# Altium schematic sheet IMX7S_CPU_POWER.SchDoc
size A2
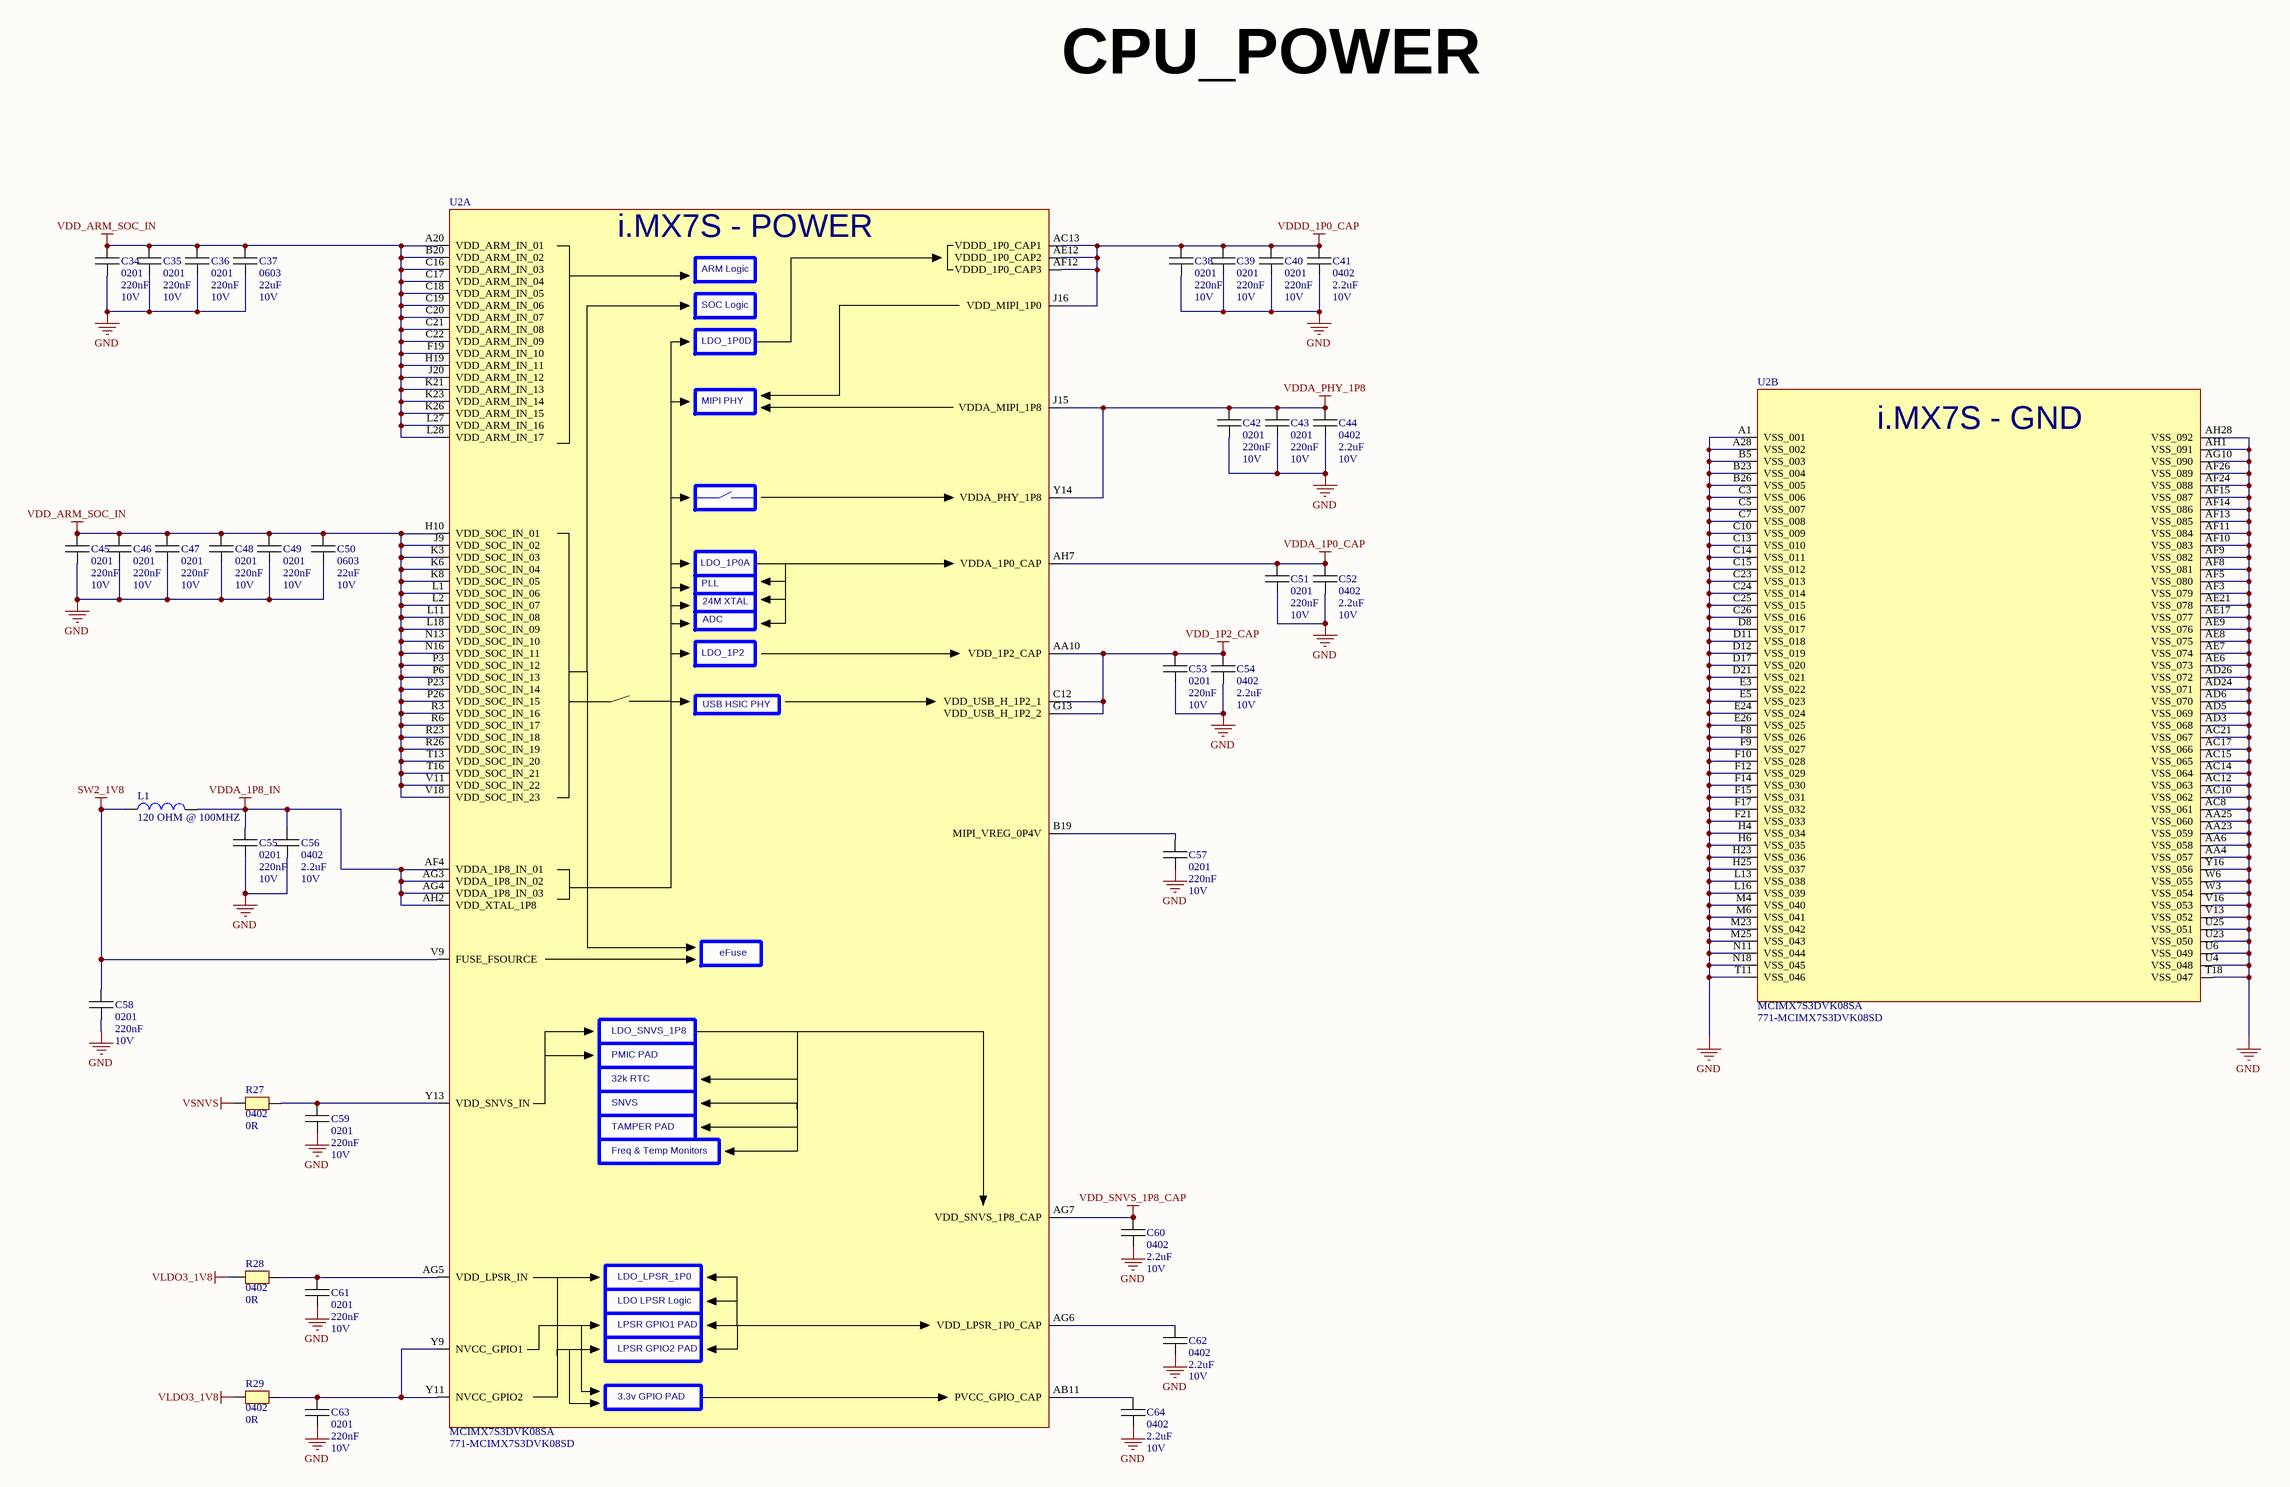
[diagram p0: IMX7S_CPU_POWER.SchDoc]

## Parts
C34  value 220nF  PACKAGE: 0201  VOLTAGE: 10V  [C0201]  (hidden comment: C0201)
C35  value 220nF  PACKAGE: 0201  VOLTAGE: 10V  [C0201]  (hidden comment: C0201)
C36  value 220nF  PACKAGE: 0201  VOLTAGE: 10V  [C0201]  (hidden comment: C0201)
C37  value 22uF  PACKAGE: 0603  VOLTAGE: 10V  [C0603]  (hidden comment: C0603)
C38  value 220nF  PACKAGE: 0201  VOLTAGE: 10V  [C0201]  (hidden comment: C0201)
C39  value 220nF  PACKAGE: 0201  VOLTAGE: 10V  [C0201]  (hidden comment: C0201)
C40  value 220nF  PACKAGE: 0201  VOLTAGE: 10V  [C0201]  (hidden comment: C0201)
C41  value 2.2uF  PACKAGE: 0402  VOLTAGE: 10V  [C0402]  (hidden comment: C0402)
C42  value 220nF  PACKAGE: 0201  VOLTAGE: 10V  [C0201]  (hidden comment: C0201)
C43  value 220nF  PACKAGE: 0201  VOLTAGE: 10V  [C0201]  (hidden comment: C0201)
C44  value 2.2uF  PACKAGE: 0402  VOLTAGE: 10V  [C0402]  (hidden comment: C0402)
C45  value 220nF  PACKAGE: 0201  VOLTAGE: 10V  [C0201]  (hidden comment: C0201)
C46  value 220nF  PACKAGE: 0201  VOLTAGE: 10V  [C0201]  (hidden comment: C0201)
C47  value 220nF  PACKAGE: 0201  VOLTAGE: 10V  [C0201]  (hidden comment: C0201)
C48  value 220nF  PACKAGE: 0201  VOLTAGE: 10V  [C0201]  (hidden comment: C0201)
C49  value 220nF  PACKAGE: 0201  VOLTAGE: 10V  [C0201]  (hidden comment: C0201)
C50  value 22uF  PACKAGE: 0603  VOLTAGE: 10V  [C0603]  (hidden comment: C0603)
C51  value 220nF  PACKAGE: 0201  VOLTAGE: 10V  [C0201]  (hidden comment: C0201)
C52  value 2.2uF  PACKAGE: 0402  VOLTAGE: 10V  [C0402]  (hidden comment: C0402)
C53  value 220nF  PACKAGE: 0201  VOLTAGE: 10V  [C0201]  (hidden comment: C0201)
C54  value 2.2uF  PACKAGE: 0402  VOLTAGE: 10V  [C0402]  (hidden comment: C0402)
C55  value 220nF  PACKAGE: 0201  VOLTAGE: 10V  [C0201]  (hidden comment: C0201)
C56  value 2.2uF  PACKAGE: 0402  VOLTAGE: 10V  [C0402]  (hidden comment: C0402)
C57  value 220nF  PACKAGE: 0201  VOLTAGE: 10V  [C0201]  (hidden comment: C0201)
C58  value 220nF  PACKAGE: 0201  VOLTAGE: 10V  [C0201]  (hidden comment: C0201)
C59  value 220nF  PACKAGE: 0201  VOLTAGE: 10V  [C0201]  (hidden comment: C0201)
C60  value 2.2uF  PACKAGE: 0402  VOLTAGE: 10V  [C0402]  (hidden comment: C0402)
C61  value 220nF  PACKAGE: 0201  VOLTAGE: 10V  [C0201]  (hidden comment: C0201)
C62  value 2.2uF  PACKAGE: 0402  VOLTAGE: 10V  [C0402]  (hidden comment: C0402)
C63  value 220nF  PACKAGE: 0201  VOLTAGE: 10V  [C0201]  (hidden comment: C0201)
C64  value 2.2uF  PACKAGE: 0402  VOLTAGE: 10V  [C0402]  (hidden comment: C0402)
L1  value 120 OHM @ 100MHZ  [SELF]  (hidden comment: Self)
R27  value 0R  PACKAGE: 0402  [R0402]  (hidden comment: R0402)
R28  value 0R  PACKAGE: 0402  [R0402]  (hidden comment: R0402)
R29  value 0R  PACKAGE: 0402  [R0402]  (hidden comment: R0402)
U2  MCIMX7S3DVK08SA  Supplier Part Number 1: 771-MCIMX7S3DVK08SD  [BGA 488 PIN]  (parts A,B of 13)

## Nets
GND: C34.1 C35.1 C36.1 C37.1 C38.1 C39.1 C40.1 C41.1 C42.1 C43.1 C44.1 C45.1 C46.1 C47.1 C48.1 C49.1 C50.1 C51.1 C52.1 C53.1 C54.1 C55.1 C56.1 C57.1 C58.1 C59.1 C60.1 C61.1 C62.1 C63.1 C64.1 U2.A1(VSS_001) U2.A28(VSS_002) U2.AA4(VSS_057) U2.AA6(VSS_058) U2.AA23(VSS_059) U2.AA25(VSS_060) U2.AC8(VSS_061) U2.AC10(VSS_062) U2.AC12(VSS_063) U2.AC14(VSS_064) U2.AC15(VSS_065) U2.AC17(VSS_066) U2.AC21(VSS_067) U2.AD3(VSS_068) U2.AD5(VSS_069) U2.AD6(VSS_070) U2.AD24(VSS_071) U2.AD26(VSS_072) U2.AE6(VSS_073) U2.AE7(VSS_074) U2.AE8(VSS_075) U2.AE9(VSS_076) U2.AE17(VSS_077) U2.AE21(VSS_078) U2.AF3(VSS_079) U2.AF5(VSS_080) U2.AF8(VSS_081) U2.AF9(VSS_082) U2.AF10(VSS_083) U2.AF11(VSS_084) U2.AF13(VSS_085) U2.AF14(VSS_086) U2.AF15(VSS_087) U2.AF24(VSS_088) U2.AF26(VSS_089) U2.AG10(VSS_090) U2.AH1(VSS_091) U2.AH28(VSS_092) U2.B5(VSS_003) U2.B23(VSS_004) U2.B26(VSS_005) U2.C3(VSS_006) U2.C5(VSS_007) U2.C7(VSS_008) U2.C10(VSS_009) U2.C13(VSS_010) U2.C14(VSS_011) U2.C15(VSS_012) U2.C23(VSS_013) U2.C24(VSS_014) U2.C25(VSS_015) U2.C26(VSS_016) U2.D8(VSS_017) U2.D11(VSS_018) U2.D12(VSS_019) U2.D17(VSS_020) U2.D21(VSS_021) U2.E3(VSS_022) U2.E5(VSS_023) U2.E24(VSS_024) U2.E26(VSS_025) U2.F8(VSS_026) U2.F9(VSS_027) U2.F10(VSS_028) U2.F12(VSS_029) U2.F14(VSS_030) U2.F15(VSS_031) U2.F17(VSS_032) U2.F21(VSS_033) U2.H4(VSS_034) U2.H6(VSS_035) U2.H23(VSS_036) U2.H25(VSS_037) U2.L13(VSS_038) U2.L16(VSS_039) U2.M4(VSS_040) U2.M6(VSS_041) U2.M23(VSS_042) U2.M25(VSS_043) U2.N11(VSS_044) U2.N18(VSS_045) U2.T11(VSS_046) U2.T18(VSS_047) U2.U4(VSS_048) U2.U6(VSS_049) U2.U23(VSS_050) U2.U25(VSS_051) U2.V13(VSS_052) U2.V16(VSS_053) U2.W3(VSS_054) U2.W6(VSS_055) U2.Y16(VSS_056)
SW2_1V8: C58.2 L1.1 U2.V9(FUSE_FSOURCE)
VDD_1P2_CAP: C53.2 C54.2 U2.AA10(VDD_1P2_CAP) U2.C12(VDD_USB_H_1P2_1) U2.G13(VDD_USB_H_1P2_2)
VDD_ARM_SOC_IN: C34.2 C35.2 C36.2 C37.2 C45.2 C46.2 C47.2 C48.2 C49.2 C50.2 U2.A20(VDD_ARM_IN_01) U2.B20(VDD_ARM_IN_02) U2.C16(VDD_ARM_IN_03) U2.C17(VDD_ARM_IN_04) U2.C18(VDD_ARM_IN_05) U2.C19(VDD_ARM_IN_06) U2.C20(VDD_ARM_IN_07) U2.C21(VDD_ARM_IN_08) U2.C22(VDD_ARM_IN_09) U2.F19(VDD_ARM_IN_10) U2.H10(VDD_SOC_IN_01) U2.H19(VDD_ARM_IN_11) U2.J9(VDD_SOC_IN_02) U2.J20(VDD_ARM_IN_12) U2.K3(VDD_SOC_IN_03) U2.K6(VDD_SOC_IN_04) U2.K8(VDD_SOC_IN_05) U2.K21(VDD_ARM_IN_13) U2.K23(VDD_ARM_IN_14) U2.K26(VDD_ARM_IN_15) U2.L1(VDD_SOC_IN_06) U2.L2(VDD_SOC_IN_07) U2.L11(VDD_SOC_IN_08) U2.L18(VDD_SOC_IN_09) U2.L27(VDD_ARM_IN_16) U2.L28(VDD_ARM_IN_17) U2.N13(VDD_SOC_IN_10) U2.N16(VDD_SOC_IN_11) U2.P3(VDD_SOC_IN_12) U2.P6(VDD_SOC_IN_13) U2.P23(VDD_SOC_IN_14) U2.P26(VDD_SOC_IN_15) U2.R3(VDD_SOC_IN_16) U2.R6(VDD_SOC_IN_17) U2.R23(VDD_SOC_IN_18) U2.R26(VDD_SOC_IN_19) U2.T13(VDD_SOC_IN_20) U2.T16(VDD_SOC_IN_21) U2.V11(VDD_SOC_IN_22) U2.V18(VDD_SOC_IN_23)
VDD_SNVS_1P8_CAP: C60.2 U2.AG7(VDD_SNVS_1P8_CAP)
VDDA_1P0_CAP: C51.2 C52.2 U2.AH7(VDDA_1P0_CAP)
VDDA_1P8_IN: C55.2 C56.2 L1.2 U2.AF4(VDDA_1P8_IN_01) U2.AG3(VDDA_1P8_IN_02) U2.AG4(VDDA_1P8_IN_03) U2.AH2(VDD_XTAL_1P8)
VDDA_PHY_1P8: C42.2 C43.2 C44.2 U2.J15(VDDA_MIPI_1P8) U2.Y14(VDDA_PHY_1P8)
VDDD_1P0_CAP: C38.2 C39.2 C40.2 C41.2 U2.AC13(VDDD_1P0_CAP1) U2.AE12(VDDD_1P0_CAP2) U2.AF12(VDDD_1P0_CAP3) U2.J16(VDD_MIPI_1P0)
VLDO3_1V8: R28.1 R29.1
VSNVS: R27.1
NetC57_2: C57.2 U2.B19(MIPI_VREG_0P4V)
NetC59_2: C59.2 R27.2 U2.Y13(VDD_SNVS_IN)
NetC61_2: C61.2 R28.2 U2.AG5(VDD_LPSR_IN)
NetC62_2: C62.2 U2.AG6(VDD_LPSR_1P0_CAP)
NetC63_2: C63.2 R29.2 U2.Y9(NVCC_GPIO1) U2.Y11(NVCC_GPIO2)
NetC64_2: C64.2 U2.AB11(PVCC_GPIO_CAP)

## Notes on the sheet
- CPU_POWER
- Title
- Size:
- Date:
- File:
- A2
- Number:
- Time:
- Revision:
- Sheet
- of
- (in symbol MCIMX7S3DVK08SD, part A) i.MX7S - POWER; ARM Logic; SOC Logic; LDO_1P0D; MIPI PHY; LDO_1P0A; PLL; 24M XTAL; ADC; LDO_1P2; USB HSIC PHY; eFuse; LDO_SNVS_1P8; PMIC PAD; 32k RTC; SNVS; TAMPER PAD; Freq & Temp Monitors; LDO_LPSR_1P0; LDO LPSR Logic; LPSR GPIO1 PAD; LPSR GPIO2 PAD; 3.3v GPIO PAD
- (in symbol MCIMX7S3DVK08SD, part B) i.MX7S - GND

## Library data of the parts
C34-C36 C38-C40 C42 C43 C45-C49 C51 C53 C55 C57-C59 C61 C63 = C0201: Manufacturer 1: Murata; Manufacturer Part Number 1: GRM033R61A224KE90D; Tolerance: 10%; Dielectric: X5R; Supplier 1: Farnell; Supplier Part Number 1: 2990687; Stock 1: 4290; Pricing 1: 10=0,04270, 100=0,02370, 500=0,01800, 2500=0,01350, 7500=0,00950, 15000=0,00760, 75000=0,00630 (EUR); RoHS: Yes; Mount: Surface Mount; Case/Package: 0201; Case Code (Metric): 0603; Case Code (Imperial): 0201; Min Operating Temperature: -55°C; Max Operating Temperature: 85°C; Capacitance: 220nF; Voltage Rating (DC): 10V; Packaging: Tape and Reel; Voltage Rating: 10V; Length: 0.024inch; Width: 0.012inch; Thickness: 0.013inch; ComponentLink1URL: http://www.mouser.com/ds/2/281/c02e-2905.pdf?src-supplier=Mouser; ComponentLink1Description: http://www.mouser.com/ds/2/281/c02e-2905.pdf?src-supplier=Mouser; ComponentLink2URL: http://search.murata.co.jp/Ceramy/image/img/A01X/G101/ENG/GRM033R61A224KE90-01.pdf?src-supplier=Digi-Key; ComponentLink2Description: http://search.murata.co.jp/Ceramy/image/img/A01X/G101/ENG/GRM033R61A224KE90-01.pdf?src-supplier=Digi-Key
C37 C50 = C0603: Manufacturer 1: Murata; Manufacturer Part Number 1: GRM188R60J226MEA0D; Description: Cap Ceramic 22uF 6.3V X5R 20% SMD 0603 85C Paper T/R; Tolerance: 20%; Voltage Rating: 6.3V; Dielectric: X5R; Supplier 1: Farnell; Supplier Part Number 1: 2666490; Stock 1: 3836000; Pricing 1: 4000=0,03830, 20000=0,03750 (EUR); RoHS: Yes; Mount: Surface Mount; Case/Package: 0603; Weight: 0.000222oz; Case Code (Metric): 1608; Case Code (Imperial): 0603; Min Operating Temperature: -55°C; Max Operating Temperature: 85°C; Capacitance: 22uF; Packaging: Tape and Reel; Package Quantity: 4000; Termination: SMD/SMT; Voltage Rating (DC): 6.3V; Length: 1.6mm; Height: 0.8mm; Width: 0.8mm; Thickness: 0.039inch; Depth: 0.8mm; REACH SVHC: No SVHC; Lead Free: Lead Free; ComponentLink1URL: https://datasheet.ciiva.com/29540/partnumbering-e-01-29540443.pdf?src-supplier=Digi-Key; ComponentLink1Description: https://datasheet.ciiva.com/29540/partnumbering-e-01-29540443.pdf?src-supplier=Digi-Key; ComponentLink2URL: https://datasheet.ciiva.com/29540/partnumbering-e-01-29540441.pdf?src-supplier=Digi-Key; ComponentLink2Description: https://datasheet.ciiva.com/29540/partnumbering-e-01-29540441.pdf?src-supplier=Digi-Key; ComponentLink3URL: https://datasheet.ciiva.com/29540/partnumbering-e-01-29540442.pdf?src-supplier=Digi-Key; ComponentLink3Description: https://datasheet.ciiva.com/29540/partnumbering-e-01-29540442.pdf?src-supplier=Digi-Key
C41 C44 C52 C54 C56 C60 C62 C64 = C0402: Manufacturer 1: Wurth Electronics; Manufacturer Part Number 1: 885012105013; Tolerance: 20%; Supplier 1: Farnell; Supplier Part Number 1: 2533930; Stock 1: 11802; Pricing 1: 10=0,21600, 100=0,14100, 500=0,10600, 2500=0,09320, 5000=0,07880, 10000=0,07420, 50000=0,06950 (EUR); RoHS: Yes; Mount: Surface Mount; Case/Package: 0402; Case Code (Metric): 1005; Case Code (Imperial): 0402; Min Operating Temperature: -55°C; Max Operating Temperature: 85°C; Packaging: Tape and Reel; Capacitance: 2.2uF; Voltage Rating: 10V; Length: 0.039inch; Width: 0.02inch; Thickness: 0.022inch; ComponentLink1URL: http://www.farnell.com/datasheets/2031748.pdf?src-supplier=Farnell; ComponentLink1Description: http://www.farnell.com/datasheets/2031748.pdf?src-supplier=Farnell; ComponentLink2URL: https://katalog.we-online.de/pbs/datasheet/885012105013.pdf?src-supplier=Digi-Key; ComponentLink2Description: https://katalog.we-online.de/pbs/datasheet/885012105013.pdf?src-supplier=Digi-Key
L1 = Self: Manufacturer 1: TDK EPCOS; Manufacturer Part Number 1: B82442H1106K; Description: 10mH Unshielded Wirewound Inductor 35mA 120 Ohm Max 2220 (5750 Metric); Core Material: Ferrite; Tolerance: 10%; Current Rating: 35mA; Inductance: 10mH; DC Resistance (DCR): 120R; Test Frequency: 79.6kHz; Shielding: Unshielded; Q Factor: 30; Self Resonant Frequency: 500kHz; Supplier 1: Farnell; Supplier Part Number 1: 158938; Stock 1: 53; Pricing 1: 1=1,69000, 50=1,11000, 100=0,80500, 250=0,71100, 500=0,61600, 1500=0,60200, 7500=0,58700 (EUR); RoHS: Yes; Mount: Surface Mount; Case/Package: 2220; Number of Pins: 2; Weight: 0.016932oz; Case Code (Metric): 5750; Case Code (Imperial): 2220; Max Operating Temperature: 150°C; Package Quantity: 1500; Packaging: Tape and Reel; Termination: SMD/SMT; Composition: Wirewound; Military Standard: Not; Max DC Current: 35mA; Inductance Tolerance: 10%; DC Current: 35mA; Series Resistance: 120R; Length: 0.22inch; Height: 5.3mm; Width: 0.197inch; Depth: 5.3mm; Height - Seated (Max): 0.197inch; Ratings: AEC-Q200; Radiation Hardening: No; REACH SVHC: No SVHC; Lead Free: Lead Free; ComponentLink1URL: https://datasheet.ciiva.com/11801/0900766b804edf2e-11801913.pdf?src-supplier=RSComponents; ComponentLink1Description: https://datasheet.ciiva.com/11801/0900766b804edf2e-11801913.pdf?src-supplier=RSComponents; ComponentLink2URL: https://datasheet.ciiva.com/1047/b82442h-1047280.pdf?src-supplier=Digi-Key; ComponentLink2Description: https://datasheet.ciiva.com/1047/b82442h-1047280.pdf?src-supplier=Digi-Key; ComponentLink3URL: https://datasheet.ciiva.com/14124/b82442h-eng-tds-14124710.pdf?src-supplier=Distrelec; ComponentLink3Description: https://datasheet.ciiva.com/14124/b82442h-eng-tds-14124710.pdf?src-supplier=Distrelec; ComponentLink4URL: https://datasheet.ciiva.com/3082/b82442h-3082505.pdf?src-supplier=Avnet; ComponentLink4Description: https://datasheet.ciiva.com/3082/b82442h-3082505.pdf?src-supplier=Avnet; ComponentLink5URL: https://datasheet.ciiva.com/28641/b82442h-28641529.pdf?src-supplier=Element14; ComponentLink5Description: https://datasheet.ciiva.com/28641/b82442h-28641529.pdf?src-supplier=Element14; ComponentLink6URL: https://datasheet.ciiva.com/8003/670300-8003258.pdf?src-supplier=Element14; ComponentLink6Description: https://datasheet.ciiva.com/8003/670300-8003258.pdf?src-supplier=Element14; ComponentLink7URL: https://datasheet.ciiva.com/1047/b82442h-1047278.pdf?src-supplier=Digi-Key; ComponentLink7Description: https://datasheet.ciiva.com/1047/b82442h-1047278.pdf?src-supplier=Digi-Key; ComponentLink8URL: https://datasheet.ciiva.com/16380/b82442h-16380542.pdf?src-supplier=Future+Electronics; ComponentLink8Description: https://datasheet.ciiva.com/16380/b82442h-16380542.pdf?src-supplier=Future+Electronics; ComponentLink9URL: https://datasheet.ciiva.com/1047/b82442h-1047279.pdf?src-supplier=Digi-Key; ComponentLink9Description: https://datasheet.ciiva.com/1047/b82442h-1047279.pdf?src-supplier=Digi-Key
R27-R29 = R0402: Manufacturer 1: Multicomp; Manufacturer Part Number 1: MCSR04X000PTL; VOLTAGE: 0V; Description: MULTICOMP - MCSR04X000 PTL - RES, 0R0, 0.0625W, 0402, CERAMIC; Power Rating: 62.5mW; Voltage Rating: 50V; Resistance: 0mR; Temperature Coefficient: 400ppm/°C; Supplier 1: Farnell; Supplier Part Number 1: 2073956; Stock 1: 1770; Pricing 1: 10=0,00730, 100=0,00640, 500=0,00540, 2500=0,00390, 5000=0,00320, 10000=0,00260, 50000=0,00200, 100000=0,00160 (EUR); RoHS: Yes; Case/Package: 0402; Case Code (Metric): 1005; Case Code (Imperial): 0402; Composition: Ceramic; Packaging: Cut Tape; Voltage Rating (DC): 50V; REACH SVHC: No SVHC; ComponentLink1URL: https://datasheet.ciiva.com/7777/1716710-7777064.pdf?src-supplier=Element14; ComponentLink1Description: https://datasheet.ciiva.com/7777/1716710-7777064.pdf?src-supplier=Element14
U2 = MCIMX7S3DVK08SD: Supplier 1: Mouser